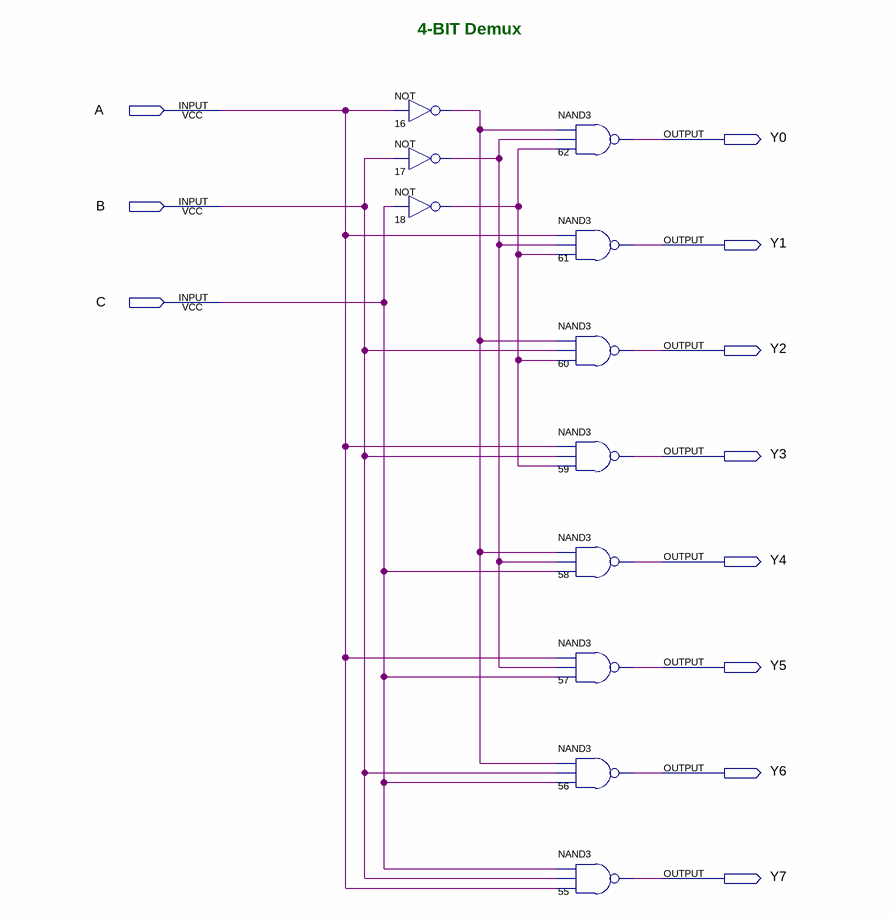
[diagram p0: schematic sheet]
// Quartus schematic 4demux.bdf as structural Verilog: 11 symbols, 11 pins
module \4demux  (
  input  A,
  input  B,
  input  C,
  output Y0,
  output Y1,
  output Y2,
  output Y3,
  output Y4,
  output Y5,
  output Y6,
  output Y7
);

  wire n16_out, n17_out, n18_out;

  not u_16 (n16_out, A);
  not u_17 (n17_out, B);
  not u_18 (n18_out, C);
  nand u_62 (Y0, n16_out, n17_out, n18_out);
  nand u_61 (Y1, A, n17_out, n18_out);
  nand u_60 (Y2, n16_out, B, n18_out);
  nand u_59 (Y3, A, B, n18_out);
  nand u_58 (Y4, n16_out, n17_out, C);
  nand u_57 (Y5, A, n17_out, C);
  nand u_56 (Y6, n16_out, B, C);
  nand u_55 (Y7, C, B, A);

  // Notes on the sheet:
  //   4-BIT Demux
endmodule
